# EAGLE board ma8x8_multiplexer (EAGLE 6.6.0), part 1 of 2
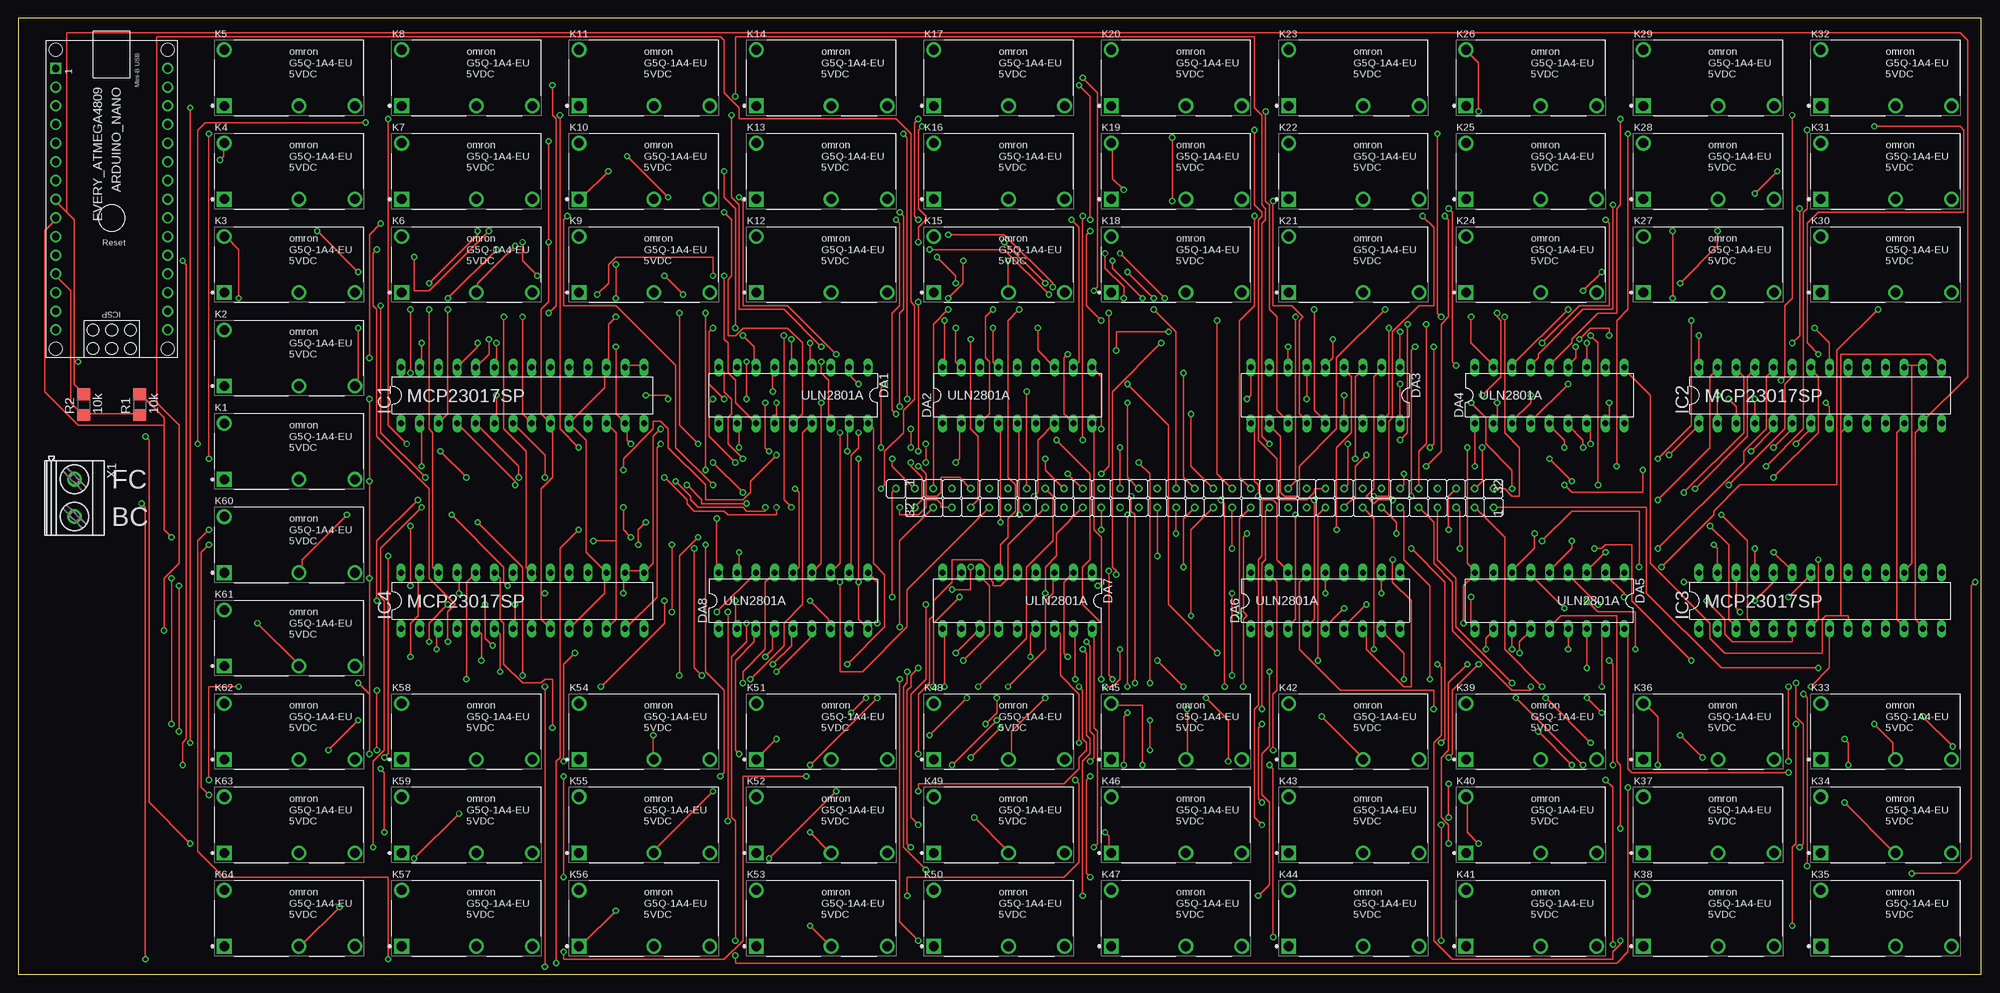
[diagram p1: board, top side]
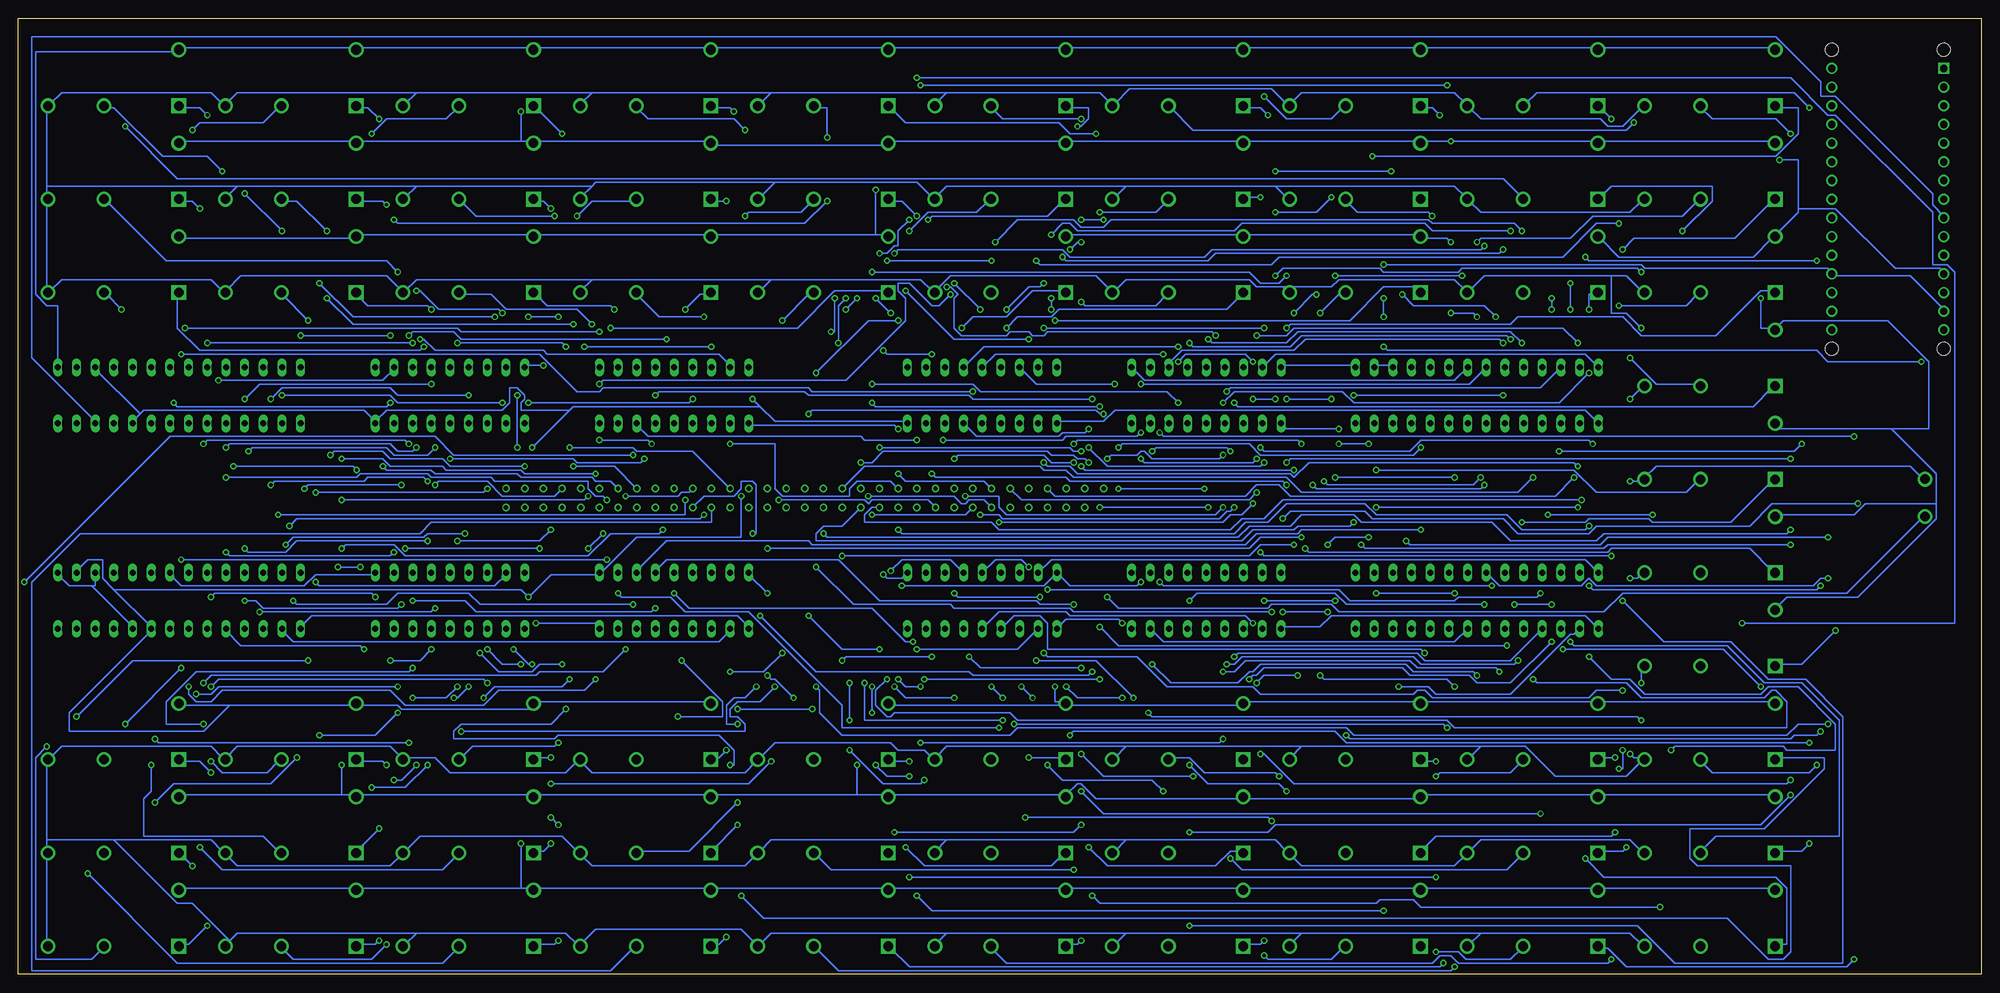
[diagram p2: board, bottom side, seen from below]

Size 267 x 130 mm. Coordinates in mm from the lower left corner, seen from the top.
Outline: 0,0 267,0 267,130 0,130 0,0
Copper layers (1*16): Top 0.035mm / dielectric 1.5mm / Bottom 0.035mm
Design rules "aisler_2_layer_simple": minimum track width 0.2mm, minimum drill 0.45mm, track to track 0.175mm, track to pad 0.175mm, pad to pad 0.175mm, via to via 0.175mm, smd to smd 0.175mm, copper to edge 0.3mm, drill to drill 0.25mm, minimum pad ring 0.2mm, minimum via ring 0.2mm, stop-mask expansion 0mil, vias tented up to drill 0mil, thermal gap 10mil

## Footprints (pad centres in the part's own frame; a part is rotated, then mirrored left to right if it is on the bottom)
ARDUINO_NANO = drill 1 square: 1 -20.32,-7.62 | drill 1: 2 -17.78,-7.62; 3 -15.24,-7.62; 4 -12.7,-7.62; 5 -10.16,-7.62; 6 -7.62,-7.62; 7 -5.08,-7.62; 8 -2.54,-7.62; 9 0,-7.62; 10 2.54,-7.62; 11 5.08,-7.62; 12 7.62,-7.62; 13 10.16,-7.62; 14 12.7,-7.62; 15 15.24,-7.62; 16 15.24,7.62; 17 12.7,7.62; 18 10.16,7.62; 19 7.62,7.62; 20 5.08,7.62; 21 2.54,7.62; 22 0,7.62; 23 -2.54,7.62; 24 -5.08,7.62; 25 -7.62,7.62; 26 -10.16,7.62; 27 -12.7,7.62; 28 -15.24,7.62; 29 -17.78,7.62; 30 -20.32,7.62 | hole 1.778: -22.86,-7.62; -22.86,7.62; 17.78,7.62; 17.78,-7.62
310-47-101-41-001000 = drill 0.6: 1 0,0
DIL18 = drill 0.813 long: 1 -10.16,-3.81; 2 -7.62,-3.81; 3 -5.08,-3.81; 4 -2.54,-3.81; 5 0,-3.81; 6 2.54,-3.81; 7 5.08,-3.81; 8 7.62,-3.81; 9 10.16,-3.81; 10 10.16,3.81; 11 7.62,3.81; 12 5.08,3.81; 13 2.54,3.81; 14 0,3.81; 15 -2.54,3.81; 16 -5.08,3.81; 17 -7.62,3.81; 18 -10.16,3.81
310-47-132-41-001000 = drill 0.6: 1 0,0; 2 0,2.54; 3 0,5.08; 4 0,7.62; 5 0,10.16; 6 0,12.7; 7 0,15.24; 8 0,17.78; 9 0,20.32; 10 0,22.86; 11 0,25.4; 12 0,27.94; 13 0,30.48; 14 0,33.02; 15 0,35.56; 16 0,38.1; 17 0,40.64; 18 0,43.18; 19 0,45.72; 20 0,48.26; 21 0,50.8; 22 0,53.34; 23 0,55.88; 24 0,58.42; 25 0,60.96; 26 0,63.5; 27 0,66.04; 28 0,68.58; 29 0,71.12; 30 0,73.66; 31 0,76.2; 32 0,78.74
DIL28-3 = drill 0.813 long: 1 -16.51,-3.81; 2 -13.97,-3.81; 3 -11.43,-3.81; 4 -8.89,-3.81; 5 -6.35,-3.81; 6 -3.81,-3.81; 7 -1.27,-3.81; 8 1.27,-3.81; 9 3.81,-3.81; 10 6.35,-3.81; 11 8.89,-3.81; 12 11.43,-3.81; 13 13.97,-3.81; 14 16.51,-3.81; 15 16.51,3.81; 16 13.97,3.81; 17 11.43,3.81; 18 8.89,3.81; 19 6.35,3.81; 20 3.81,3.81; 21 1.27,3.81; 22 -1.27,3.81; 23 -3.81,3.81; 24 -6.35,3.81; 25 -8.89,3.81; 26 -11.43,3.81; 27 -13.97,3.81; 28 -16.51,3.81
OMRON_G5Q-1A4-EU_DC5_0 = drill 1.3 pad 2 square: 1 -8.82,-3.81 | drill 1.3 pad 2: 2 1.34,-3.81; 3 8.96,-3.81; 5 -8.82,3.81
R1206 = smd 1.6 x 1.803: 1 -1.422,0; 2 1.422,0
MKDSN1,5/2-5,08 = drill 1.3 pad 2: 1 -2.561,0.025; 2 2.519,0.025

## Placement (x,y rotation side)
ARDUINO_NANO  EVERY_ATMEGA4809  [ARDUINO_NANO]  12.7,102.87 270 top
BC  310-47-101-41-001000  [310-47-101-41-001000]  119.38,66.04 0 top
DA1  ULN2801A  [DIL18]  105.41,78.74 180 top
DA2  ULN2801A  [DIL18]  135.89,78.74 0 top
DA3  ULN2801A  [DIL18]  177.8,78.74 180 top
DA4  ULN2801A  [DIL18]  208.28,78.74 0 top
DA5  ULN2801A  [DIL18]  208.28,50.8 180 top
DA6  ULN2801A  [DIL18]  177.8,50.8 0 top
DA7  ULN2801A  [DIL18]  135.89,50.8 180 top
DA8  ULN2801A  [DIL18]  105.41,50.8 0 top
H1  310-47-132-41-001000  [310-47-132-41-001000]  121.92,66.04 270 top
H2  310-47-132-41-001000  [310-47-132-41-001000]  200.66,63.5 90 top
IC1  MCP23017SP  [DIL28-3]  68.58,78.74 0 top
IC2  MCP23017SP  [DIL28-3]  245.11,78.74 0 top
IC3  MCP23017SP  [DIL28-3]  245.11,50.8 0 top
IC4  MCP23017SP  [DIL28-3]  68.58,50.8 0 top
K1  OMRON_G5Q-1A4-EU_DC5  [OMRON_G5Q-1A4-EU_DC5_0]  36.83,71.12 0 top
K2  OMRON_G5Q-1A4-EU_DC5  [OMRON_G5Q-1A4-EU_DC5_0]  36.83,83.82 0 top
K3  OMRON_G5Q-1A4-EU_DC5  [OMRON_G5Q-1A4-EU_DC5_0]  36.83,96.52 0 top
K4  OMRON_G5Q-1A4-EU_DC5  [OMRON_G5Q-1A4-EU_DC5_0]  36.83,109.22 0 top
K5  OMRON_G5Q-1A4-EU_DC5  [OMRON_G5Q-1A4-EU_DC5_0]  36.83,121.92 0 top
K6  OMRON_G5Q-1A4-EU_DC5  [OMRON_G5Q-1A4-EU_DC5_0]  60.96,96.52 0 top
K7  OMRON_G5Q-1A4-EU_DC5  [OMRON_G5Q-1A4-EU_DC5_0]  60.96,109.22 0 top
K8  OMRON_G5Q-1A4-EU_DC5  [OMRON_G5Q-1A4-EU_DC5_0]  60.96,121.92 0 top
K9  OMRON_G5Q-1A4-EU_DC5  [OMRON_G5Q-1A4-EU_DC5_0]  85.09,96.52 0 top
K10  OMRON_G5Q-1A4-EU_DC5  [OMRON_G5Q-1A4-EU_DC5_0]  85.09,109.22 0 top
K11  OMRON_G5Q-1A4-EU_DC5  [OMRON_G5Q-1A4-EU_DC5_0]  85.09,121.92 0 top
K12  OMRON_G5Q-1A4-EU_DC5  [OMRON_G5Q-1A4-EU_DC5_0]  109.22,96.52 0 top
K13  OMRON_G5Q-1A4-EU_DC5  [OMRON_G5Q-1A4-EU_DC5_0]  109.22,109.22 0 top
K14  OMRON_G5Q-1A4-EU_DC5  [OMRON_G5Q-1A4-EU_DC5_0]  109.22,121.92 0 top
K15  OMRON_G5Q-1A4-EU_DC5  [OMRON_G5Q-1A4-EU_DC5_0]  133.35,96.52 0 top
K16  OMRON_G5Q-1A4-EU_DC5  [OMRON_G5Q-1A4-EU_DC5_0]  133.35,109.22 0 top
K17  OMRON_G5Q-1A4-EU_DC5  [OMRON_G5Q-1A4-EU_DC5_0]  133.35,121.92 0 top
K18  OMRON_G5Q-1A4-EU_DC5  [OMRON_G5Q-1A4-EU_DC5_0]  157.48,96.52 0 top
K19  OMRON_G5Q-1A4-EU_DC5  [OMRON_G5Q-1A4-EU_DC5_0]  157.48,109.22 0 top
K20  OMRON_G5Q-1A4-EU_DC5  [OMRON_G5Q-1A4-EU_DC5_0]  157.48,121.92 0 top
K21  OMRON_G5Q-1A4-EU_DC5  [OMRON_G5Q-1A4-EU_DC5_0]  181.61,96.52 0 top
K22  OMRON_G5Q-1A4-EU_DC5  [OMRON_G5Q-1A4-EU_DC5_0]  181.61,109.22 0 top
K23  OMRON_G5Q-1A4-EU_DC5  [OMRON_G5Q-1A4-EU_DC5_0]  181.61,121.92 0 top
K24  OMRON_G5Q-1A4-EU_DC5  [OMRON_G5Q-1A4-EU_DC5_0]  205.74,96.52 0 top
K25  OMRON_G5Q-1A4-EU_DC5  [OMRON_G5Q-1A4-EU_DC5_0]  205.74,109.22 0 top
K26  OMRON_G5Q-1A4-EU_DC5  [OMRON_G5Q-1A4-EU_DC5_0]  205.74,121.92 0 top
K27  OMRON_G5Q-1A4-EU_DC5  [OMRON_G5Q-1A4-EU_DC5_0]  229.87,96.52 0 top
K28  OMRON_G5Q-1A4-EU_DC5  [OMRON_G5Q-1A4-EU_DC5_0]  229.87,109.22 0 top
K29  OMRON_G5Q-1A4-EU_DC5  [OMRON_G5Q-1A4-EU_DC5_0]  229.87,121.92 0 top
K30  OMRON_G5Q-1A4-EU_DC5  [OMRON_G5Q-1A4-EU_DC5_0]  254,96.52 0 top
K31  OMRON_G5Q-1A4-EU_DC5  [OMRON_G5Q-1A4-EU_DC5_0]  254,109.22 0 top
K32  OMRON_G5Q-1A4-EU_DC5  [OMRON_G5Q-1A4-EU_DC5_0]  254,121.92 0 top
K33  OMRON_G5Q-1A4-EU_DC5  [OMRON_G5Q-1A4-EU_DC5_0]  254,33.02 0 top
K34  OMRON_G5Q-1A4-EU_DC5  [OMRON_G5Q-1A4-EU_DC5_0]  254,20.32 0 top
K35  OMRON_G5Q-1A4-EU_DC5  [OMRON_G5Q-1A4-EU_DC5_0]  254,7.62 0 top
K36  OMRON_G5Q-1A4-EU_DC5  [OMRON_G5Q-1A4-EU_DC5_0]  229.87,33.02 0 top
K37  OMRON_G5Q-1A4-EU_DC5  [OMRON_G5Q-1A4-EU_DC5_0]  229.87,20.32 0 top
K38  OMRON_G5Q-1A4-EU_DC5  [OMRON_G5Q-1A4-EU_DC5_0]  229.87,7.62 0 top
K39  OMRON_G5Q-1A4-EU_DC5  [OMRON_G5Q-1A4-EU_DC5_0]  205.74,33.02 0 top
K40  OMRON_G5Q-1A4-EU_DC5  [OMRON_G5Q-1A4-EU_DC5_0]  205.74,20.32 0 top
K41  OMRON_G5Q-1A4-EU_DC5  [OMRON_G5Q-1A4-EU_DC5_0]  205.74,7.62 0 top
K42  OMRON_G5Q-1A4-EU_DC5  [OMRON_G5Q-1A4-EU_DC5_0]  181.61,33.02 0 top
K43  OMRON_G5Q-1A4-EU_DC5  [OMRON_G5Q-1A4-EU_DC5_0]  181.61,20.32 0 top
K44  OMRON_G5Q-1A4-EU_DC5  [OMRON_G5Q-1A4-EU_DC5_0]  181.61,7.62 0 top
K45  OMRON_G5Q-1A4-EU_DC5  [OMRON_G5Q-1A4-EU_DC5_0]  157.48,33.02 0 top
K46  OMRON_G5Q-1A4-EU_DC5  [OMRON_G5Q-1A4-EU_DC5_0]  157.48,20.32 0 top
K47  OMRON_G5Q-1A4-EU_DC5  [OMRON_G5Q-1A4-EU_DC5_0]  157.48,7.62 0 top
K48  OMRON_G5Q-1A4-EU_DC5  [OMRON_G5Q-1A4-EU_DC5_0]  133.35,33.02 0 top
K49  OMRON_G5Q-1A4-EU_DC5  [OMRON_G5Q-1A4-EU_DC5_0]  133.35,20.32 0 top
K50  OMRON_G5Q-1A4-EU_DC5  [OMRON_G5Q-1A4-EU_DC5_0]  133.35,7.62 0 top
K51  OMRON_G5Q-1A4-EU_DC5  [OMRON_G5Q-1A4-EU_DC5_0]  109.22,33.02 0 top
K52  OMRON_G5Q-1A4-EU_DC5  [OMRON_G5Q-1A4-EU_DC5_0]  109.22,20.32 0 top
K53  OMRON_G5Q-1A4-EU_DC5  [OMRON_G5Q-1A4-EU_DC5_0]  109.22,7.62 0 top
K54  OMRON_G5Q-1A4-EU_DC5  [OMRON_G5Q-1A4-EU_DC5_0]  85.09,33.02 0 top
K55  OMRON_G5Q-1A4-EU_DC5  [OMRON_G5Q-1A4-EU_DC5_0]  85.09,20.32 0 top
K56  OMRON_G5Q-1A4-EU_DC5  [OMRON_G5Q-1A4-EU_DC5_0]  85.09,7.62 0 top
K57  OMRON_G5Q-1A4-EU_DC5  [OMRON_G5Q-1A4-EU_DC5_0]  60.96,7.62 0 top
K58  OMRON_G5Q-1A4-EU_DC5  [OMRON_G5Q-1A4-EU_DC5_0]  60.96,33.02 0 top
K59  OMRON_G5Q-1A4-EU_DC5  [OMRON_G5Q-1A4-EU_DC5_0]  60.96,20.32 0 top
K60  OMRON_G5Q-1A4-EU_DC5  [OMRON_G5Q-1A4-EU_DC5_0]  36.83,58.42 0 top
K61  OMRON_G5Q-1A4-EU_DC5  [OMRON_G5Q-1A4-EU_DC5_0]  36.83,45.72 0 top
K62  OMRON_G5Q-1A4-EU_DC5  [OMRON_G5Q-1A4-EU_DC5_0]  36.83,33.02 0 top
K63  OMRON_G5Q-1A4-EU_DC5  [OMRON_G5Q-1A4-EU_DC5_0]  36.83,20.32 0 top
K64  OMRON_G5Q-1A4-EU_DC5  [OMRON_G5Q-1A4-EU_DC5_0]  36.83,7.62 0 top
R1  10k  [R1206]  16.51,77.47 90 top
R2  10k  [R1206]  8.89,77.47 90 top
X1  MKDSN1,5/2-5,08  [MKDSN1,5/2-5,08]  7.62,64.77 270 top

## Tracks (layer width: path | path; a pad name or v marks a point on that pad's centre or on a via)
5V  (via drill 0.45)
  Top 0.2: v147.32,74.17 147.32,81.28 DA2.10 | v197.61,51.31 197.61,47.75 198.12,47.24 DA5.10 | 247.9,48.77 248.92,48.77 IC3.9 | 247.9,48.77 245.87,48.77 245.36,48.26 245.36,43.69 232.16,43.69 230.12,45.72 230.12,47.75 222,55.88 222,78.74 218.44,82.3 DA4.10 | 247.9,73.66 248.92,74.68 IC2.9 | 247.9,48.77 247.9,73.66 | 247.9,73.66 247.9,84.33 260.1,84.33 261.62,82.8 IC2.15 | v168.66,65.02 168.66,66.55 168.15,67.06 168.15,74.17 167.64,74.68 DA3.10 | v125.98,39.12 125.98,46.74 DA7.10 | DA8.10 116.84,53.34 v116.84,47.75 | v223.01,28.45 223.01,35.05 221.49,36.58 K36.5 | v152.91,28.45 152.91,36.58 148.84,36.58 K45.5 | v198.63,17.78 197.1,19.3 197.1,23.88 K40.5 | v87.38,74.17 86.36,73.15 86.36,55.88 IC4.15 84.84,54.86 82.8,54.86 IC4.16 82.3,54.36 v82.3,51.82 | IC4.9 71.12,48.26 71.12,51.82 | 71.12,51.82 71.12,66.04 72.64,67.56 72.64,74.68 IC1.9 71.12,76.2 71.12,90.42 72.14,91.44 v72.14,99.57 v72.14,113.28 | 71.12,51.82 v71.63,51.82 | v29.97,91.95 29.97,98.55 28.45,100.08 K3.5 | v150.37,106.68 148.84,108.2 148.84,112.78 K19.5 | v27.43,110.74 27.94,111.25 27.94,112.78 K4.5 | v198.63,117.35 198.63,123.95 197.1,125.48 K26.5 | R1.1 16.26,76.2 9.14,76.2 R2.1 8.64,76.2 7.11,77.72 7.11,92.96 5.08,95 ARDUINO_NANO.12
  Bottom 0.2: K35.5 244.86,11.68 221.49,11.68 K38.5 220.98,11.68 198.63,11.68 | K64.5 28.45,11.68 51.82,11.68 K57.5 52.32,11.68 76.2,11.68 K56.5 76.71,11.68 100.08,11.68 K53.5 100.58,11.68 124.46,11.68 K50.5 124.97,11.68 148.34,11.68 K47.5 148.84,11.68 172.72,11.68 K44.5 173.23,11.68 196.6,11.68 K41.5 197.1,11.68 198.63,11.68 | v147.32,74.17 147.83,74.68 167.64,74.68 DA3.10 | 254,52.32 255.52,53.85 255.52,56.39 257.56,56.39 259.08,54.86 IC3.16 | 254,52.32 248.92,47.24 IC3.9 248.92,46.74 260.1,35.56 260.1,33.02 241.81,33.02 238.25,36.58 | 254,52.32 198.63,52.32 v197.61,51.31 194.56,54.36 187.96,54.36 DA6.10 187.96,54.86 187.45,54.86 182.88,59.44 168.66,59.44 v168.66,65.02 | v125.98,39.12 125.98,37.08 124.97,37.08 K48.5 | v116.84,47.75 117.35,48.26 124.46,48.26 DA7.10 | K45.5 148.34,36.58 124.97,36.58 K48.5 | K62.5 28.45,37.08 51.82,37.08 K58.5 52.32,37.08 76.2,37.08 K54.5 76.71,37.08 100.08,37.08 K51.5 100.58,36.58 124.46,36.58 K48.5 | K42.5 173.23,37.08 196.6,37.08 K39.5 197.1,36.58 197.61,36.07 214.88,36.07 215.39,36.58 220.98,36.58 K36.5 221.49,36.58 238.25,36.58 | 238.25,36.58 244.86,36.58 K33.5 | K63.5 28.45,24.38 51.82,24.38 K59.5 52.32,24.38 76.2,24.38 K55.5 76.71,23.88 100.08,23.88 K52.5 100.58,23.88 120.4,23.88 122.43,25.91 122.94,25.91 124.46,24.38 K49.5 124.97,24.38 148.34,24.38 K46.5 148.84,24.38 152.91,24.38 | 223.01,24.38 244.86,24.38 K34.5 | 223.01,24.38 221.49,24.38 K37.5 220.98,24.38 197.1,24.38 K40.5 196.6,24.38 173.23,24.38 K43.5 172.72,24.38 152.91,24.38 | 223.01,24.38 v223.01,28.45 | 152.91,24.38 v152.91,28.45 | v198.63,17.78 198.63,11.68
  Bottom 0.2: K5.5 28.45,125.98 51.82,125.98 K8.5 52.32,125.98 76.2,125.98 K11.5 76.71,125.98 100.08,125.98 K14.5 100.58,125.98 124.46,125.98 K17.5 124.97,125.98 148.34,125.98 K20.5 148.84,125.98 172.72,125.98 K23.5 173.23,125.98 196.6,125.98 K26.5 197.1,125.98 220.98,125.98 K29.5 221.49,125.98 244.86,125.98 K32.5 245.36,125.48 264.67,125.48 264.67,92.46 263.14,90.93 261.62,90.93 IC2.15 | DA1.10 94.49,74.17 v87.38,74.17 | K15.5 124.46,100.58 100.58,100.58 K12.5 100.08,100.58 76.71,100.58 K9.5 76.2,100.08 72.64,100.08 v72.14,99.57 | v71.63,51.82 v82.3,51.82 | K6.5 51.82,100.08 49.28,97.54 30.99,97.54 28.45,100.08 K3.5 27.94,100.58 24.89,103.63 24.89,104.14 | v29.97,91.95 29.97,87.88 28.45,87.88 K2.5 27.94,87.88 26.92,88.9 12.7,88.9 7.11,83.31 7.11,74.17 12.19,74.17 | K30.5 244.86,100.08 221.49,100.08 K27.5 220.98,100.58 197.1,100.58 K24.5 196.6,100.58 173.23,100.58 K21.5 172.72,100.58 150.37,100.58 | 150.37,100.58 148.84,100.58 K18.5 | K31.5 244.86,113.28 221.49,113.28 K28.5 220.98,113.28 198.63,113.28 | K4.5 28.45,113.28 51.82,113.28 K7.5 52.32,113.28 v72.14,113.28 76.2,113.28 K10.5 76.71,113.28 100.08,113.28 K13.5 100.58,113.28 124.46,113.28 K16.5 124.97,113.28 148.34,113.28 K19.5 148.84,112.78 172.72,112.78 K22.5 173.23,113.28 196.6,113.28 K25.5 197.1,113.28 198.63,113.28 | v150.37,106.68 150.37,100.58 | 24.89,104.14 24.89,110.74 v27.43,110.74 | 198.63,113.28 v198.63,117.35 | 24.89,104.14 19.81,104.14 11.68,96.01 5.59,96.01 5.08,95.5 ARDUINO_NANO.12 | 6.1,64.01 6.1,61.98 16.76,51.31 26.42,51.31 27.94,49.78 K61.5 | 6.1,64.01 15.75,64.01 17.27,62.48 27.94,62.48 K60.5
  Bottom 0.2: 12.19,74.17 27.43,74.17 27.94,74.68 K1.5 | 12.19,74.17 6.1,68.07 6.1,64.01
BC  (via drill 0.45)
  Top 0.2: BC.1 118.87,65.53 v118.87,51.31
  Bottom 0.2: v118.87,51.31 117.35,49.78 97.03,49.78 96.52,50.29 88.39,50.29 87.38,49.28 51.31,49.28 48.77,51.82 18.29,51.82 8.13,61.98 X1.2
FC  (via drill 0.45)
  Top 0.2: 47.75,38.1 v46.23,39.62 | v47.75,29.97 47.75,38.1 | 47.75,38.1 v47.75,53.85 v47.75,67.06 v47.75,78.23 | v46.23,87.88 46.23,80.26 K2.3
  Bottom 0.2: K5.3 46.23,117.86 48.77,115.32 50.8,115.32 51.82,116.33 68.07,116.33 69.6,117.86 K8.3 70.1,118.36 71.63,119.89 92.46,119.89 93.98,118.36 K11.3 94.49,118.36 96.52,120.4 115.82,120.4 117.86,118.36 K14.3 118.36,118.36 119.89,119.89 140.72,119.89 | 140.72,119.89 142.24,118.36 K17.3 | 164.59,119.89 166.12,118.36 K20.3 | 140.72,119.89 164.59,119.89 | 188.98,119.89 190.5,118.36 K23.3 | 164.59,119.89 188.98,119.89 | 212.85,119.89 214.38,118.36 K26.3 | 188.98,119.89 212.85,119.89 | 212.85,119.89 237.24,119.89 238.76,118.36 K29.3 239.27,118.36 240.79,119.89 261.11,119.89 262.64,118.36 K32.3 263.14,117.86 263.14,107.19 | 50.29,95 67.56,95 69.6,92.96 K6.3 70.1,92.96 71.63,94.49 87.38,94.49 88.39,93.47 95,93.47 | 50.29,95 48.26,95 46.23,92.96 K3.3 | 95,93.47 94.49,92.96 K9.3 | 95,93.47 98.55,93.47 99.57,94.49 116.33,94.49 117.86,92.96 K12.3 118.36,92.96 120.4,95 140.21,95 142.24,92.96 K15.3 142.75,92.96 144.27,94.49 164.59,94.49 | 164.59,94.49 166.12,92.96 K18.3 | 188.98,94.49 190.5,92.96 K21.3 | 164.59,94.49 188.98,94.49 | 188.98,94.49 212.85,94.49 214.38,92.96 K24.3 214.88,92.96 216.92,95 236.73,95 238.76,92.96 K27.3 239.27,92.96 240.79,94.49 261.11,94.49 262.64,92.96 K30.3 263.14,92.96 263.14,105.16 K31.3 263.14,105.66 263.14,107.19 | K4.3 46.23,105.16 47.75,103.63 68.07,103.63 69.6,105.16 K7.3 70.1,105.66 71.63,107.19 96.01,107.19 | 96.01,107.19 94.49,105.66 K10.3 | 116.33,107.19 96.01,107.19 | 116.33,107.19 117.86,105.66 K13.3 | 116.33,107.19 140.72,107.19 142.24,105.66 K16.3 142.75,105.66 144.78,107.7 164.08,107.7 | 164.08,107.7 166.12,105.66 K19.3
  Bottom 0.2: 188.98,107.19 188.47,107.7 164.08,107.7 | 188.98,107.19 190.5,105.66 K22.3 | 212.85,107.19 214.38,105.66 K25.3 | 188.98,107.19 212.85,107.19 | 237.24,107.19 238.76,105.66 K28.3 | 212.85,107.19 237.24,107.19 | 237.24,107.19 263.14,107.19 | X1.1 8.13,67.56 9.65,69.09 44.2,69.09 45.72,67.56 K1.3 46.23,67.06 v47.75,67.06 | 68.07,30.99 61.98,30.99 57.91,26.92 48.26,26.92 46.23,28.96 K62.3 46.23,29.46 47.24,29.46 v47.75,29.97 | 68.07,30.99 69.6,29.46 K58.3 | 92.46,30.99 93.98,29.46 K54.3 | 68.07,30.99 92.46,30.99 | 116.33,30.99 117.86,29.46 K51.3 | 92.46,30.99 116.33,30.99 | 116.33,30.99 140.72,30.99 142.24,29.46 K48.3 142.75,29.46 143.76,30.48 147.32,30.48 148.34,31.5 164.08,31.5 166.12,29.46 K45.3 166.62,28.96 168.15,27.43 188.98,27.43 190.5,28.96 K42.3 191.01,28.96 192.53,27.43 208.28,27.43 210.31,29.46 214.38,29.46 K39.3 214.88,29.46 216.41,30.99 237.24,30.99 238.76,29.46 K36.3 239.27,29.46 240.79,30.99 261.11,30.99 262.64,29.46 K33.3 263.14,28.96 263.14,18.29 | v46.23,39.62 46.23,41.66 K61.3 | v47.75,53.85 46.74,53.85 46.23,54.36 K60.3 | v47.75,78.23 46.23,79.76 K2.3 | K63.3 46.23,16.76 47.75,18.29 68.07,18.29 69.6,16.76 K59.3 70.1,16.26 71.63,14.73 92.46,14.73 93.98,16.26 K55.3 94.49,16.76 96.01,18.29 116.33,18.29 | 116.33,18.29 117.86,16.76 K52.3 | 140.72,18.29 142.24,16.76 K49.3 | 116.33,18.29 140.72,18.29 | 140.72,18.29 164.59,18.29 166.12,16.76 K46.3 166.62,16.26 168.15,14.73 188.98,14.73 190.5,16.26 K43.3 191.01,16.76 193.04,18.8 212.34,18.8 214.38,16.76 K40.3 214.88,16.26 216.41,14.73 237.24,14.73 238.76,16.26 K37.3 239.27,16.76 240.79,18.29 254,18.29
  Bottom 0.2: 68.07,5.59 47.75,5.59 46.23,4.06 K64.3 | 68.07,5.59 69.6,4.06 K57.3 | 92.46,5.59 93.98,4.06 K56.3 | 68.07,5.59 92.46,5.59 | 116.33,5.59 117.86,4.06 K53.3 | 92.46,5.59 116.33,5.59 | 140.72,5.59 142.24,4.06 K50.3 | 116.33,5.59 140.72,5.59 | 140.72,5.59 164.59,5.59 166.12,4.06 K47.3 166.62,4.06 168.66,6.1 188.47,6.1 190.5,4.06 K44.3 191.01,4.06 192.53,5.59 212.85,5.59 | 212.85,5.59 214.38,4.06 K41.3 | 238.25,4.57 237.24,5.59 212.85,5.59 | 238.25,4.57 238.76,4.06 K38.3 238.25,4.57 | K35.3 263.14,4.06 263.14,16.26 K34.3 263.14,16.76 263.14,18.29 | 263.14,18.29 254,18.29 | 238.25,4.57 243.33,9.65 245.36,9.65 254,18.29 | 50.29,95 50.29,89.92 48.26,89.92 v46.23,87.88
GND  (via drill 0.45)
  Top 0.2: IC1.16 82.8,82.8 84.84,82.8 IC1.15 | IC4.10 79.76,51.82 79.76,54.36 IC4.17 77.22,57.4 77.22,72.64 IC1.10 79.76,79.76 79.76,82.3 IC1.17 80.26,82.8 80.26,88.39 v81.28,89.41 | 257.56,82.8 259.08,82.8 IC2.16 | 257.56,82.8 256.54,82.8 IC2.17 | 257.56,82.8 257.56,55.88 256.54,54.86 IC3.17 | v196.6,47.75 196.6,52.83 198.12,54.36 DA5.9 198.12,54.86 197.1,55.88 v197.1,71.63 | DA8.9 114.3,48.26 v114.3,53.34 v114.3,70.1 | v167.13,78.23 167.64,78.74 DA3.9 | v146.81,52.83 147.32,53.34 147.32,59.44 146.3,60.45 146.3,74.68 DA2.9 | DA1.9 96.01,81.79 96.01,79.25 97.03,78.23 97.03,76.2 96.52,75.69 96.52,72.14 v98.55,70.1 | v81.28,91.95 v81.28,96.52
  Bottom 0.2: DA1.9 95,82.8 85.34,82.8 IC1.15 | IC1.16 82.3,82.8 80.26,82.8 IC1.17 | 257.05,52.83 251.46,47.24 IC3.10 | 257.05,52.83 260.1,52.83 261.62,54.36 IC3.15 | IC3.17 256.54,52.83 257.05,52.83 | 218.44,75.18 219.96,76.71 249.94,76.71 250.44,76.2 | 250.44,76.2 251.46,75.18 IC2.10 | 250.44,76.2 256.54,82.3 IC2.17 | v196.6,47.75 188.47,47.75 187.96,47.24 DA6.9 | v114.3,53.34 114.81,52.83 123.95,52.83 DA7.9 127.51,52.83 v146.81,52.83 | v167.13,78.23 166.12,77.22 | 166.12,77.22 164.08,75.18 146.3,75.18 DA2.9 | 192.02,76.71 191.52,77.22 166.12,77.22 | 192.02,76.71 v197.1,71.63 | 218.44,75.18 216.92,76.71 201.17,76.71 200.15,77.72 200.15,79.76 199.14,79.76 198.12,78.74 198.12,78.23 198.63,77.72 198.63,76.71 192.02,76.71 | 218.44,75.18 DA4.9 | v98.55,70.1 99.06,69.6 113.79,69.6 v114.3,70.1 | ARDUINO_NANO.14 5.08,90.42 9.65,95 20.32,95 ARDUINO_NANO.19 20.32,95.5 20.83,96.01 45.72,96.01 46.23,96.52 v81.28,96.52 | v81.28,89.41 v81.28,91.95
H1  (via drill 0.45)
  Top 0.2: H1.1 118.87,69.09 v118.87,70.1 | v103.12,70.61 99.57,67.06 99.57,65.53 98.55,64.52 93.47,64.52 93.47,66.55 88.39,71.63 88.39,74.17 87.38,75.18 86.36,75.18 86.36,74.17 82.3,70.1 v82.3,68.58
  Bottom 0.2: v118.87,70.1 118.36,70.61 114.81,70.61 114.3,71.12 113.79,71.12 112.78,70.1 103.63,70.1 v103.12,70.61 | v82.3,68.58 55.37,68.58 52.32,65.53 40.13,65.53 38.61,67.06 K1.2
H2  (via drill 0.45)
  Top 0.2: H1.2 124.46,88.39 v126.49,90.42 | v126.49,91.95 128.52,93.98 v128.52,97.03 | v49.28,102.11 47.75,100.58 v47.75,83.82
  Bottom 0.2: v126.49,91.95 v126.49,90.42 | v128.52,97.03 128.02,96.52 96.52,96.52 95.5,97.54 56.9,97.54 52.32,102.11 v49.28,102.11 | v47.75,83.82 44.2,80.26 38.61,80.26 K2.2
H3  (via drill 0.45)
  Top 0.2: v55.37,67.56 49.28,73.66 v49.28,90.93
  Bottom 0.2: H1.3 125.98,65.02 100.08,65.02 98.55,66.55 95.5,66.55 93.98,65.02 57.91,65.02 v55.37,67.56 | v49.28,90.93 40.13,90.93 38.61,92.46 K3.2
H4  (via drill 0.45)
  Top 0.2: H1.4 128.02,67.56 125.48,67.56 125.48,65.53 124.97,65.02 123.44,65.02 123.44,68.07 v122.43,69.09 | v93.47,89.92 v93.47,68.58 | v87.88,95 v90.42,92.46 | v70.61,95 68.58,97.03 v68.58,99.57
  Bottom 0.2: v122.43,69.09 121.92,68.58 v93.47,68.58 | v93.47,89.92 90.93,92.46 v90.42,92.46 | v70.61,95 v87.88,95 | v68.58,99.57 68.07,100.08 55.88,100.08 52.83,103.12 40.64,103.12 38.61,105.16 K4.2
H5  (via drill 0.45)
  Top 0.2: v94.49,69.6 v98.55,65.53 | v25.91,114.3 v25.91,70.1
  Bottom 0.2: H1.5 130.56,64.52 99.57,64.52 v98.55,65.53 | v94.49,69.6 93.98,70.1 v25.91,70.1 | v25.91,114.3 27.94,116.33 36.58,116.33 38.1,117.86 K5.2
H6  (via drill 0.45)
  Top 0.2: v147.32,68.07 148.34,69.09 v148.34,89.92 | v150.37,91.95 150.37,93.47 147.83,96.01 v147.83,98.04 | v67.56,99.06 62.48,93.98 62.48,92.96 K6.2
  Bottom 0.2: H1.6 135.64,67.06 146.3,67.06 v147.32,68.07 | v150.37,91.95 v148.34,89.92 | v147.83,98.04 147.32,98.55 124.97,98.55 123.95,97.54 105.66,97.54 104.65,98.55 68.07,98.55 v67.56,99.06
H7  (via drill 0.45)
  Top 0.2: v137.16,79.25 H1.7 | v244.86,84.33 243.33,85.85 243.33,102.11 244.86,103.63 264.67,103.63 264.67,114.81 264.16,115.32 v252.48,115.32
  Bottom 0.2: v137.16,79.25 159,79.25 159.51,79.76 187.45,79.76 187.96,79.25 191.01,79.25 196.09,84.33 v244.86,84.33 | v252.48,115.32 245.36,108.2 65.02,108.2 62.48,105.66 K7.2
H8  (via drill 0.45)
  Top 0.2: H1.8 140.72,65.02 140.72,58.93 137.16,55.37 137.16,45.72 v130.56,39.12 | v123.95,32.51 v129.03,37.59 | v23.37,117.86 v23.37,31.5
  Bottom 0.2: v129.03,37.59 v130.56,39.12 | v123.95,32.51 123.44,33.02 87.88,33.02 86.36,31.5 v23.37,31.5 | v23.37,117.86 25.4,119.89 60.45,119.89 61.98,118.36 K8.2
H9  (via drill 0.45)
  Top 0.2: H1.9 139.7,68.58 v139.7,70.1 | v123.44,72.14 v123.44,69.6 | v92.46,72.14 89.92,74.68 v89.92,89.92
  Bottom 0.2: v139.7,70.1 139.19,70.61 127.51,70.61 126.49,69.6 v123.44,69.6 | v123.44,72.14 122.94,72.64 92.96,72.64 v92.46,72.14 | v89.92,89.92 87.38,92.46 86.87,92.46 K9.2
H10  (via drill 0.45)
  Top 0.2: v142.75,68.07 H1.10 | v94.49,66.55 89.41,71.63 89.41,82.8 81.28,90.93 74.17,90.93 74.17,102.62 v74.68,103.12
  Bottom 0.2: v142.75,68.07 142.24,67.56 124.46,67.56 123.95,67.06 95,67.06 v94.49,66.55 | v74.68,103.12 75.18,103.63 84.84,103.63 86.36,105.16 K10.2
H11  (via drill 0.45)
  Top 0.2: v170.18,72.14 169.16,73.15 169.16,102.11 169.67,102.62 169.67,104.14 169.16,104.65 169.16,116.84 168.15,117.86 168.15,127.51 97.54,127.51 v97.54,119.38
  Bottom 0.2: H1.11 148.34,67.06 152.91,67.06 153.92,66.04 153.92,65.02 163.07,65.02 164.08,66.04 164.08,72.14 v170.18,72.14 | v97.54,119.38 94.49,116.33 88.39,116.33 86.87,117.86 K11.2
H12  (via drill 0.45)
  Top 0.2: v149.86,71.63 H1.12 | v122.43,91.44 v122.43,71.12
  Bottom 0.2: v149.86,71.63 123.95,71.63 123.44,71.12 v122.43,71.12 | v122.43,91.44 121.92,90.93 112.27,90.93 110.74,92.46 K12.2
H13  (via drill 0.45)
  Top 0.2: H1.13 150.88,67.56 v150.88,77.72 | v119.89,77.22 119.89,89.92 120.4,90.42 120.4,103.12 v119.89,103.63
  Bottom 0.2: v150.88,77.72 150.37,77.22 v119.89,77.22 | v119.89,103.63 112.27,103.63 110.74,105.16 K13.2
H14  (via drill 0.45)
  Top 0.2: v57.4,71.12 v60.96,67.56 | v24.38,72.14 24.38,114.81 25.4,115.82 v47.24,115.82
  Bottom 0.2: H1.14 151.89,69.09 128.02,69.09 127.51,68.58 124.46,68.58 123.44,67.56 94.49,67.56 92.46,65.53 62.99,65.53 v60.96,67.56 | v57.4,71.12 25.4,71.12 v24.38,72.14 | v47.24,115.82 48.26,114.81 107.19,114.81 110.24,117.86 K14.2
H15  (via drill 0.45)
  Top 0.2: H1.15 157.48,87.38 v154.43,90.42 | v152.91,91.95 148.84,96.01 v148.84,97.03 | v134.62,97.03 134.62,92.96 K15.2
  Bottom 0.2: v152.91,91.95 v154.43,90.42 | v134.62,97.03 v148.84,97.03
H16  (via drill 0.45)
  Top 0.2: H1.16 158.5,67.56 v158.5,81.79 | v147.32,88.9 145.29,90.93 145.29,100.58 v145.8,101.09
  Bottom 0.2: v158.5,81.79 151.38,88.9 v147.32,88.9 | v145.8,101.09 143.26,103.63 136.65,103.63 135.13,105.16 K16.2
H17  (via drill 0.45)
  Top 0.2: H1.17 159.51,69.09 v159.51,76.2 | v119.38,76.2 118.87,76.71 118.87,89.92 119.89,90.93 119.89,102.11 v119.38,102.62 | v122.43,102.62 121.92,103.12 121.92,115.82 v122.43,116.33
  Bottom 0.2: v159.51,76.2 159,76.71 120.4,76.71 119.89,76.2 v119.38,76.2 | v122.43,102.62 v119.38,102.62 | v122.43,116.33 133.1,116.33 134.62,117.86 K17.2
H18  (via drill 0.45)
  Top 0.2: H1.18 163.07,68.07 v163.07,88.9
  Bottom 0.2: v163.07,88.9 159.51,92.46 159,92.46 K18.2
H19  (via drill 0.45)
  Top 0.2: H1.19 166.12,67.56 166.12,88.9 168.15,90.93 v168.15,103.12
  Bottom 0.2: v168.15,103.12 167.64,103.63 160.53,103.63 159,105.16 K19.2
H20  (via drill 0.45)
  Top 0.2: v192.02,71.63 192.53,72.14 v192.53,85.34 | v207.26,85.85 212.34,90.93 216.41,90.93 216.41,102.11 v215.9,102.62 | v156.97,113.79 v156.97,105.16
  Bottom 0.2: H1.20 175.26,71.12 182.88,71.12 183.39,71.63 v192.02,71.63 | v192.53,85.34 193.04,85.85 v207.26,85.85 | v215.9,102.62 215.39,102.11 160.02,102.11 v156.97,105.16 | v156.97,113.79 156.97,117.86 158.5,117.86 K20.2
H21  (via drill 0.45)
  Top 0.2: H1.21 173.74,67.06 v173.74,89.41
  Bottom 0.2: v173.74,89.41 179.83,89.41 182.88,92.46 K21.2
H22  (via drill 0.45)
  Top 0.2: v184.4,65.02 186.44,65.02 186.44,75.18 186.94,75.69 186.94,87.38 190.5,90.93 192.53,90.93 192.53,101.6 v191.01,103.12
  Bottom 0.2: H1.22 175.77,65.53 176.78,65.53 177.29,65.02 v184.4,65.02 | v191.01,103.12 188.98,105.16 183.39,105.16 K22.2
H23  (via drill 0.45)
  Top 0.2: H1.23 176.28,66.04 176.28,65.53 175.26,64.52 171.7,64.52 171.2,65.02 171.2,70.1 168.66,72.64 168.66,102.62 169.16,103.12 169.16,103.63 168.15,104.65 v168.15,114.81
  Bottom 0.2: v168.15,114.81 169.67,116.33 181.36,116.33 182.88,117.86 K23.2
H24  (via drill 0.45)
  Top 0.2: H1.24 180.85,66.55 v180.85,72.14 | v187.96,72.64 188.98,73.66 v188.98,88.39
  Bottom 0.2: v180.85,72.14 181.36,72.64 v187.96,72.64 | v188.98,88.39 191.01,90.42 200.66,90.42 202.69,92.46 206.76,92.46 K24.2
H25  (via drill 0.45)
  Top 0.2: v191.52,69.09 193.55,71.12 193.55,88.39 194.56,89.41 194.56,102.62 v194.06,103.12
  Bottom 0.2: H1.25 185.93,69.09 v191.52,69.09 | v194.06,103.12 204.72,103.12 206.76,105.16 K25.2
H26  (via drill 0.45)
  Top 0.2: v217.42,69.09 217.42,88.9 218.95,90.42 v218.95,114.3
  Bottom 0.2: H1.26 186.44,67.06 188.47,67.06 188.98,67.56 198.63,67.56 199.14,68.07 210.31,68.07 210.82,68.58 216.92,68.58 v217.42,69.09 | v218.95,114.3 216.92,116.33 208.79,116.33 207.26,117.86 K26.2
H27  (via drill 0.45)
  Top 0.2: H1.27 188.47,66.55 v188.47,68.07 | v223.01,70.1 227.58,74.68 v227.58,88.9
  Bottom 0.2: v188.47,68.07 198.12,68.07 198.63,68.58 208.79,68.58 209.3,69.09 216.41,69.09 217.42,70.1 v223.01,70.1 | v227.58,88.9 231.14,92.46 K27.2
H28  (via drill 0.45)
  Top 0.2: H1.28 190.5,71.12 191.52,72.14 v191.52,88.39 | v225.04,101.09 v225.04,91.95
  Bottom 0.2: v191.52,88.39 221.49,88.39 v225.04,91.95 | v225.04,101.09 229.11,105.16 231.14,105.16 K28.2
H29  (via drill 0.45)
  Top 0.2: v210.31,66.55 211.33,65.53 220.98,65.53 v220.98,68.58 | v237.74,69.09 242.82,74.17 242.82,103.63 243.33,104.14 v243.33,114.81
  Bottom 0.2: H1.29 194.06,65.02 201.17,65.02 203.2,67.06 209.8,67.06 v210.31,66.55 | v220.98,68.58 221.49,69.09 v237.74,69.09 | v243.33,114.81 242.32,115.82 233.68,115.82 231.65,117.86 K29.2
H30  (via drill 0.45)
  Top 0.2: H1.30 194.56,65.02 v194.56,60.45 | v207.26,58.93 211.33,62.99 220.47,62.99 v220.47,55.37 | v223.52,55.37 230.63,62.48 230.63,62.99 234.19,66.55 247.4,66.55 247.4,84.84 v252.98,90.42
  Bottom 0.2: v194.56,60.45 196.09,58.93 v207.26,58.93 | v223.52,55.37 v220.47,55.37 | v252.98,90.42 255.02,92.46 K30.2
H31  (via drill 0.45)
  Top 0.2: H1.31 199.14,67.06 v199.14,71.63 | v199.14,78.74 201.68,81.28 201.68,88.9 201.17,89.41 v201.17,89.92 | v215.39,95.5 v212.85,92.96
  Bottom 0.2: v199.14,78.74 v199.14,71.63 | v201.17,89.92 201.68,90.42 209.8,90.42 212.34,92.96 v212.85,92.96 | v215.39,95.5 216.92,97.03 246.89,97.03 255.02,105.16 K31.2
H32  (via drill 0.45)
  Top 0.2: H1.32 202.18,66.04 203.2,65.02 204.22,65.02 204.22,71.63 202.18,73.66 v202.18,89.41 | v226.06,93.98 231.14,99.06 v231.14,101.09 | v239.27,109.22 v236.22,106.17
  Bottom 0.2: v202.18,89.41 221.49,89.41 v226.06,93.98 | v236.22,106.17 v231.14,101.09 | v239.27,109.22 241.3,111.25 247.4,111.25 254,117.86 255.02,117.86 K32.2
H33  (via drill 0.45)
  Top 0.2: H2.1 221.49,63.5 221.49,51.82 231.65,41.66 v244.86,41.66 | v252.48,34.04 255.02,31.5 255.02,29.46 K33.2
  Bottom 0.2: v252.48,34.04 v244.86,41.66
H34  (via drill 0.45)
  Top 0.2: H2.2 202.18,59.44 202.18,44.2 v207.26,39.12 | v215.39,35.56 v213.36,37.59 | v229.11,29.46 v226.06,32.51 | v248.41,23.37 255.02,16.76 K34.2
  Bottom 0.2: v207.26,39.12 208.79,37.59 v213.36,37.59 | v215.39,35.56 218.44,32.51 v226.06,32.51 | v229.11,29.46 232.66,25.91 245.87,25.91 v248.41,23.37
H35  (via drill 0.45)
  Top 0.2: H2.3 196.09,62.99 v196.09,57.91 | v214.38,57.91 215.39,57.91 215.9,58.42 219.46,58.42 219.46,50.8 v227.58,42.67 | v263.14,30.99 v259.08,35.05
  Bottom 0.2: v214.38,57.91 v196.09,57.91 | v227.58,42.67 251.46,42.67 v259.08,35.05 | v263.14,30.99 264.67,29.46 264.67,2.03 257.05,2.03 255.52,3.56 K35.2
H36  (via drill 0.45)
  Top 0.2: H2.4 193.04,56.39 195.58,53.85 195.58,47.24 v203.2,39.62 | v240.79,28.96 v240.79,39.12
  Bottom 0.2: v203.2,39.62 203.71,40.13 239.78,40.13 v240.79,39.12 | v240.79,28.96 239.27,27.43 233.17,27.43 231.65,28.96 K36.2
H37  (via drill 0.45)
  Top 0.2: H2.5 192.53,61.47 192.53,55.88 195.07,53.34 195.07,46.74 203.2,38.61 205.74,38.61 v205.74,39.12 | v213.87,31.5 v207.77,37.59 | v248.41,32 248.92,31.5 v248.92,28.45
  Bottom 0.2: v205.74,39.12 207.26,37.59 v207.77,37.59 | v213.87,31.5 247.9,31.5 v248.41,32 | v248.92,28.45 248.92,24.89 249.94,23.88 249.94,18.8 233.68,18.8 231.65,16.76 K37.2
H38  (via drill 0.45)
  Top 0.2: H2.6 188.47,62.99 188.47,56.39 192.02,52.83 v192.02,40.13 | v212.85,28.45 v203.71,37.59 | v215.9,26.42 216.92,25.4 v216.92,4.06
  Bottom 0.2: v192.02,40.13 193.04,39.12 202.18,39.12 v203.71,37.59 | v212.85,28.45 214.88,26.42 v215.9,26.42 | v216.92,4.06 218.95,2.03 229.62,2.03 231.14,3.56 K38.2
H39  (via drill 0.45)
  Top 0.2: H2.7 187.45,61.47 v187.45,59.94 | v189.48,57.91 194.06,53.34 194.06,32 v193.55,31.5
  Bottom 0.2: v189.48,57.91 v187.45,59.94 | v193.55,31.5 194.06,30.99 205.23,30.99 206.76,29.46 K39.2
H40  (via drill 0.45)
  Top 0.2: H2.8 184.4,61.98 v184.4,44.2 | v241.81,39.62 241.81,35.05 242.82,34.04 242.82,17.78 v242.32,17.27
  Bottom 0.2: v184.4,44.2 187.45,41.15 196.09,41.15 196.6,40.64 240.79,40.64 v241.81,39.62 | v242.32,17.27 239.27,14.22 209.3,14.22 207.26,16.26 K40.2
H41  (via drill 0.45)
  Top 0.2: H2.9 181.86,65.02 181.86,69.09 v183.39,70.61 | v266.19,53.34 265.68,52.83 265.68,15.75 263.65,13.72 v257.56,13.72
  Bottom 0.2: v183.39,70.61 207.77,70.61 210.31,73.15 246.38,73.15 v266.19,53.34 | v257.56,13.72 245.36,1.52 209.3,1.52 207.26,3.56 K41.2
H42  (via drill 0.45)
  Top 0.2: H2.10 176.78,62.48 v176.78,42.67 | v177.29,35.05 182.88,29.46 K42.2
  Bottom 0.2: v176.78,42.67 171.2,37.08 171.2,35.05 v177.29,35.05
H43  (via drill 0.45)
  Top 0.2: v167.13,59.94 166.62,59.44 166.62,49.28 167.13,48.77 166.62,48.26 v166.62,39.12 | v169.16,34.04 168.66,33.53 168.66,23.88 v169.16,23.37
  Bottom 0.2: H2.11 173.74,65.02 169.67,65.02 168.66,66.04 168.66,67.06 167.13,67.06 166.62,66.55 166.62,59.94 v167.13,59.94 | v166.62,39.12 168.15,37.59 169.67,37.59 170.69,36.58 170.69,34.04 v169.16,34.04 | v169.16,23.37 175.77,16.76 182.88,16.76 K43.2
H44
  Bottom 0.2: H2.12 172.72,61.47 210.82,61.47 212.34,59.94 258.57,59.94 265.18,53.34 265.18,0.51 186.44,0.51 183.39,3.56 K44.2
H45  (via drill 0.45)
  Top 0.2: H2.13 169.67,62.99 169.67,56.39 169.16,55.88 v169.16,36.07 | v159,36.07 159,29.46 K45.2
  Bottom 0.2: v159,36.07 v169.16,36.07
H46  (via drill 0.45)
  Top 0.2: H2.14 166.12,61.98 v166.12,48.77 | v120.9,41.15 120.9,39.62 120.4,39.12 120.4,17.27 v123.44,14.22
  Bottom 0.2: v166.12,48.77 158.5,41.15 137.67,41.15 137.16,40.64 121.41,40.64 v120.9,41.15 | v123.44,14.22 156.46,14.22 158.5,16.26 K46.2
H47  (via drill 0.45)
  Top 0.2: v165.1,57.91 H2.15 | v92.46,59.44 89.92,56.9 v89.92,40.64 | v71.63,1.02 v71.63,39.12
  Bottom 0.2: v165.1,57.91 99.57,57.91 98.04,59.44 v92.46,59.44 | v89.92,40.64 89.41,40.13 72.64,40.13 v71.63,39.12 | v71.63,1.02 72.14,0.51 155.45,0.51 158.5,3.56 K47.2
H48  (via drill 0.45)
  Top 0.2: H2.16 159.51,60.45 v159.51,48.77 | v149.86,44.2 149.86,40.13 148.84,39.12 v147.83,39.12 | v139.7,37.59 135.13,33.02 135.13,29.46 K48.2
  Bottom 0.2: v159.51,48.77 154.94,44.2 v149.86,44.2 | v147.83,39.12 146.3,37.59 v139.7,37.59
H49  (via drill 0.45)
  Top 0.2: H2.17 158.5,61.98 v158.5,55.37 | v96.52,20.83 v96.52,49.28 | v130.05,21.34 134.62,16.76 K49.2
  Bottom 0.2: v158.5,55.37 153.42,50.29 140.21,50.29 139.7,49.78 123.95,49.78 123.44,49.28 v96.52,49.28 | v96.52,20.83 97.03,21.34 v130.05,21.34
H50  (via drill 0.45)
  Top 0.2: v157.48,59.94 H2.18 | v25.91,60.45 24.38,58.93 24.38,16.76 27.94,13.21 50.29,13.21 v50.29,2.03
  Bottom 0.2: v157.48,59.94 156.97,59.44 101.09,59.44 99.57,60.96 93.98,60.96 92.46,62.48 85.34,62.48 84.33,61.47 66.55,61.47 64.01,58.93 52.32,58.93 51.31,59.94 26.42,59.94 v25.91,60.45 | v50.29,2.03 50.8,1.52 71.12,1.52 72.14,2.54 73.66,2.54 74.68,1.52 132.59,1.52 134.62,3.56 K50.2
H51  (via drill 0.45)
  Top 0.2: v154.94,56.9 H2.19 | v93.47,58.42 93.47,41.15 96.01,38.61 96.01,27.43 v95.5,26.92
  Bottom 0.2: v154.94,56.9 99.57,56.9 98.04,58.42 v93.47,58.42 | v95.5,26.92 96.01,27.43 105.66,27.43 107.7,29.46 110.24,29.46 K51.2
H52  (via drill 0.45)
  Top 0.2: v85.34,61.47 84.33,60.45 v84.33,58.42 | v25.91,58.42 24.89,57.4 24.89,25.4 v25.91,24.38 | v107.7,19.3 110.24,16.76 K52.2
  Bottom 0.2: H2.20 154.94,60.96 157.48,60.96 158.5,59.94 158.5,58.93 100.58,58.93 99.06,60.45 93.47,60.45 92.96,60.96 85.85,60.96 v85.34,61.47 | v84.33,58.42 83.82,57.91 51.31,57.91 50.8,58.42 v25.91,58.42 | v25.91,24.38 29.97,20.32 96.01,20.32 97.03,19.3 v107.7,19.3
H53  (via drill 0.45)
  Top 0.2: v54.36,64.52 48.77,58.93 v48.77,50.8 | v107.7,6.6 110.24,4.06 K53.2
  Bottom 0.2: H2.21 150.88,63.5 151.89,62.48 151.89,61.47 134.62,61.47 133.6,60.45 102.11,60.45 100.58,61.98 97.54,61.98 95,64.52 v54.36,64.52 | v48.77,50.8 43.18,45.21 34.04,45.21 28.96,40.13 23.88,40.13 18.8,35.05 18.8,1.52 41.66,1.52 46.74,6.6 v107.7,6.6
H54  (via drill 0.45)
  Top 0.2: v147.32,60.45 H2.22 | v53.34,52.83 v53.34,60.96 | v21.84,33.02 v21.84,52.83 | v86.36,32.51 86.36,29.46 K54.2
  Bottom 0.2: v147.32,60.45 146.81,59.94 101.6,59.94 100.08,61.47 97.03,61.47 94.49,64.01 83.82,64.01 82.3,62.48 64.52,62.48 62.48,60.45 53.85,60.45 v53.34,60.96 | v53.34,52.83 52.83,52.32 22.35,52.32 v21.84,52.83 | v21.84,33.02 22.35,32.51 25.4,32.51 25.91,32 85.85,32 v86.36,32.51
H55  (via drill 0.45)
  Top 0.2: H2.23 141.22,59.94 141.22,56.9 139.7,55.37 v139.7,51.82 | v128.02,51.31 124.46,47.75 v124.46,39.12 | v107.7,28.45 v116.84,37.59 | v94.49,24.89 86.87,17.27 86.87,16.76 K55.2
  Bottom 0.2: v139.7,51.82 139.19,51.31 v128.02,51.31 | v124.46,39.12 122.94,37.59 v116.84,37.59 | v107.7,28.45 105.16,25.91 95.5,25.91 v94.49,24.89
H56  (via drill 0.45)
  Top 0.2: v163.58,64.52 164.08,64.01 v164.08,39.12 | v211.33,28.45 v206.76,33.02 | v218.95,25.4 218.95,3.05 217.42,1.52 97.54,1.52 v97.54,2.54
  Bottom 0.2: H2.24 143.26,64.52 150.88,64.52 151.38,64.01 151.89,64.52 v163.58,64.52 | v164.08,39.12 166.12,37.08 169.16,37.08 170.18,36.07 170.18,35.05 169.16,35.05 168.15,34.04 168.15,33.02 v206.76,33.02 | v211.33,28.45 214.38,25.4 v218.95,25.4 | v97.54,2.54 97.03,2.03 88.39,2.03 86.87,3.56 K56.2
H57  (via drill 0.45)
  Top 0.2: H2.25 134.62,58.42 134.62,53.85 133.6,52.83 132.59,52.83 132.59,53.34 132.08,53.85 132.08,55.37 131.06,56.39 127,56.39 127,53.34 124.46,50.8 124.46,48.77 123.95,48.26 123.95,39.62 122.43,38.1 v122.43,29.97 | v107.19,26.92 98.55,26.92 98.55,4.57 96.01,2.03 74.17,2.03 v74.17,3.05
  Bottom 0.2: v122.43,29.97 119.38,26.92 v107.19,26.92 | v74.17,3.05 71.12,3.05 70.1,2.03 64.01,2.03 62.48,3.56 K57.2
H58  (via drill 0.45)
  Top 0.2: v150.88,39.12 v150.88,62.48 | v150.88,35.56 150.37,35.05 v150.37,28.45 | v145.8,26.92 145.29,26.42 145.29,13.72 v145.8,13.21 | v74.17,26.92 v74.17,13.21
  Bottom 0.2: H2.26 138.18,62.48 v150.88,62.48 | v150.88,35.56 v150.88,39.12 | v150.37,28.45 148.84,26.92 v145.8,26.92 | v74.17,13.21 v145.8,13.21 | v74.17,26.92 73.66,27.43 64.01,27.43 62.48,28.96 K58.2
H59  (via drill 0.45)
  Top 0.2: v151.38,65.02 151.38,62.99 151.89,62.48 v151.89,39.62 | v127,28.45 v133.1,34.54 | v102.11,15.75 v111.25,24.89
  Bottom 0.2: H2.27 135.64,64.52 137.67,64.52 138.18,64.01 138.68,64.01 139.7,65.02 v151.38,65.02 | v151.89,39.62 151.89,34.54 v133.1,34.54 | v127,28.45 124.97,26.42 112.78,26.42 v111.25,24.89 | v102.11,15.75 100.58,14.22 64.52,14.22 62.48,16.26 K59.2
H60  (via drill 0.45)
  Top 0.2: H2.28 120.9,52.32 120.9,47.24 114.81,41.15 111.76,41.15 v111.76,53.34 | v66.55,52.83 66.04,53.34 66.04,55.37 v58.93,62.48 | v44.7,62.48 38.61,56.39 38.61,54.86 K60.2
  Bottom 0.2: v111.76,53.34 111.25,52.83 v66.55,52.83 | v44.7,62.48 v58.93,62.48
H61  (via drill 0.45)
  Top 0.2: H2.29 130.56,64.52 130.56,73.15 129.54,74.17 v129.54,86.36 | v146.3,92.96 146.81,93.47 146.81,119.89 v144.78,121.92 | v32.51,47.75 38.1,42.16 K61.2
  Bottom 0.2: v129.54,86.36 139.7,86.36 v146.3,92.96 | v144.78,121.92 25.91,121.92 20.83,116.84 19.81,116.84 6.6,103.63 6.6,96.52 4.57,96.52 3.56,95.5 3.56,47.75 v32.51,47.75
H62  (via drill 0.45)
  Top 0.2: H2.30 125.48,63.5 125.48,64.01 124.97,64.52 123.44,64.52 123.44,63.5 122.43,62.48 119.89,62.48 v119.89,63.5 | v105.16,63.5 104.14,64.52 v104.14,86.87 | v140.72,93.47 140.72,93.98 134.11,100.58 v126.49,100.58 | v64.01,101.09 55.88,92.96 53.85,92.96 v53.85,97.54 | v22.35,97.03 22.86,96.52 22.86,32 22.35,31.5 v22.35,28.45
  Bottom 0.2: v105.16,63.5 v119.89,63.5 | v104.14,86.87 104.65,87.38 127,87.38 127.51,86.87 129.03,86.87 129.54,87.38 132.08,87.38 132.59,86.87 138.68,86.87 139.7,87.88 139.7,91.95 139.19,92.46 140.21,93.47 v140.72,93.47 | v126.49,100.58 124.97,102.11 123.95,102.11 122.94,101.09 101.6,101.09 100.58,102.11 75.69,102.11 74.68,101.09 v64.01,101.09 | v53.85,97.54 53.34,97.03 v22.35,97.03 | v22.35,28.45 23.37,27.43 36.58,27.43 38.1,28.96 K62.2
H63  (via drill 0.45)
  Top 0.2: H2.31 119.89,58.93 v119.89,47.24 | v64.52,44.7 63.5,45.72 v63.5,50.29 | v58.42,50.29 55.88,47.75 v55.88,45.21
  Bottom 0.2: v119.89,47.24 117.35,44.7 v64.52,44.7 | v58.42,50.29 v63.5,50.29 | v55.88,45.21 55.37,44.7 34.54,44.7 29.46,39.62 24.38,39.62 19.3,34.54 19.3,18.8 36.07,18.8 38.1,16.76 K63.2
H64  (via drill 0.45)
  Top 0.2: H2.32 122.94,64.52 122.94,67.56 121.41,69.09 v121.41,69.6 | v152.4,69.6 153.92,68.07 v153.92,39.62 | v153.92,30.48 v153.92,34.54 | v143.76,26.42 144.27,25.91 144.27,15.24 142.24,13.21 120.9,13.21 v120.9,10.67 | v43.69,9.14 38.61,4.06 K64.2
  Bottom 0.2: v121.41,69.6 121.92,70.1 122.94,70.1 123.44,70.61 126.49,70.61 127,71.12 149.35,71.12 150.88,69.6 v152.4,69.6 | v153.92,34.54 v153.92,39.62 | v153.92,30.48 149.35,25.91 144.27,25.91 v143.76,26.42 | v120.9,10.67 119.89,9.65 82.3,9.65 81.79,10.16 77.22,10.16 76.2,9.14 v43.69,9.14
IO1  (via drill 0.45)
  Top 0.2: DA1.18 116.33,74.17 116.33,55.88 117.86,54.36 117.86,47.24 v112.78,42.16 | v68.58,40.64 68.58,55.37 v62.48,61.47
  Bottom 0.2: v112.78,42.16 110.24,39.62 101.09,39.62 99.57,41.15 99.06,41.15 98.04,42.16 78.23,42.16 77.22,41.15 69.09,41.15 v68.58,40.64 | v62.48,61.47 53.85,61.47 53.34,61.98 45.21,61.98 44.7,61.47 34.04,61.47 28.45,67.06 K1.1
IO2  (via drill 0.45)
  Top 0.2: v112.78,71.12 112.78,74.68 DA1.17 | v102.11,71.12 101.6,71.63 v101.6,77.72
  Bottom 0.2: v112.78,71.12 112.27,71.63 102.62,71.63 v102.11,71.12 | v101.6,77.72 101.09,77.22 30.99,77.22 28.45,79.76 K2.1
IO3  (via drill 0.45)
  Top 0.2: v109.22,83.31 109.22,81.79 110.24,80.77 110.24,75.18 DA1.16 | v99.06,78.23 v99.06,83.31 | v96.01,78.23 93.98,80.26 93.98,87.38 v94.49,87.88
  Bottom 0.2: v109.22,83.31 108.2,84.33 100.08,84.33 v99.06,83.31 | v96.01,78.23 v99.06,78.23 | v94.49,87.88 93.98,88.39 64.01,88.39 62.99,89.41 48.77,89.41 46.23,86.87 36.07,86.87 29.97,92.96 28.45,92.96 K3.1
IO4  (via drill 0.45)
  Top 0.2: DA1.15 106.68,73.66 106.68,50.29 104.14,47.75 104.14,44.7 v99.57,40.13 | v58.42,45.21 58.42,49.28 59.44,50.29 55.88,53.85 55.88,66.04 48.77,73.15 48.77,90.42 48.26,90.93 48.26,98.04 v48.77,98.55
  Bottom 0.2: v99.57,40.13 99.06,40.64 98.55,40.64 97.54,41.66 78.74,41.66 77.72,40.64 69.6,40.64 68.58,39.62 64.01,39.62 v58.42,45.21 | v48.77,98.55 47.24,100.08 33.53,100.08 28.45,105.16 K4.1
IO5  (via drill 0.45)
  Top 0.2: DA1.14 106.68,76.2 106.68,85.85 104.65,87.88 98.55,87.88 97.54,86.87 96.52,86.87 96.52,94.49 97.03,95 97.03,102.62 v96.01,103.63 | v82.8,111.25 v88.39,105.66
  Bottom 0.2: v96.01,103.63 90.42,103.63 v88.39,105.66 | v82.8,111.25 27.94,111.25 24.89,114.3 24.89,117.86 27.94,117.86 K5.1
IO6  (via drill 0.45)
  Top 0.2: v103.12,77.72 103.12,75.18 DA1.13 | v53.34,90.42 v53.34,81.79
  Bottom 0.2: v103.12,77.72 101.6,79.25 86.87,79.25 85.34,77.72 57.4,77.72 v53.34,81.79 | v53.34,90.42 53.34,92.46 52.32,92.46 K6.1
IO7  (via drill 0.45)
  Top 0.2: DA1.12 97.54,77.72 97.54,80.77 96.52,81.79 96.52,85.85 96.01,86.36 v96.01,95 | v40.64,101.09 v46.23,95.5
  Bottom 0.2: v96.01,95 95,96.01 81.79,96.01 81.28,95.5 71.12,95.5 70.61,96.01 46.74,96.01 v46.23,95.5 | v40.64,101.09 36.58,105.16 36.58,107.19 50.29,107.19 51.82,105.66 K7.1
IO8  (via drill 0.45)
  Top 0.2: v98.04,71.63 98.04,74.68 DA1.11 | v52.83,72.14 50.29,74.68 v50.29,116.33
  Bottom 0.2: v98.04,71.63 97.54,71.12 77.72,71.12 76.2,72.64 53.34,72.64 v52.83,72.14 | v50.29,116.33 51.82,117.86 K8.1
IO9  (via drill 0.45)
  Top 0.2: v125.98,88.9 125.98,82.8 DA2.18
  Bottom 0.2: v125.98,88.9 85.85,88.9 81.28,93.47 77.22,93.47 76.71,92.96 K9.1
IO10  (via drill 0.45)
  Top 0.2: DA2.17 127.51,83.31 v127.51,87.88 | v97.54,87.88 97.54,104.14 96.01,105.66 v96.01,109.22 | v80.26,109.22 76.71,105.66 K10.1
  Bottom 0.2: v97.54,87.88 v127.51,87.88 | v80.26,109.22 v96.01,109.22
IO11  (via drill 0.45)
  Top 0.2: v117.86,80.26 117.35,79.76 v117.35,71.63 | v76.2,71.63 73.66,74.17 v73.66,116.84
  Bottom 0.2: DA2.16 128.52,80.26 v117.86,80.26 | v117.35,71.63 116.84,72.14 99.57,72.14 98.04,70.61 77.22,70.61 v76.2,71.63 | v73.66,116.84 74.68,117.86 76.2,117.86 K11.1
IO12  (via drill 0.45)
  Top 0.2: DA2.15 132.59,83.31 v132.59,87.88
  Bottom 0.2: v132.59,87.88 131.06,89.41 126.49,89.41 125.48,90.42 102.62,90.42 100.58,92.46 K12.1
IO13  (via drill 0.45)
  Top 0.2: v111.25,84.33 104.65,90.93 98.55,90.93 98.55,105.16 v98.04,105.66
  Bottom 0.2: DA2.14 134.11,84.33 v111.25,84.33 | v98.04,105.66 100.08,105.66 K13.1
IO14  (via drill 0.45)
  Top 0.2: v109.22,85.34 104.14,90.42 98.04,90.42 98.04,104.65 97.03,105.66 v97.03,116.84
  Bottom 0.2: DA2.13 135.64,85.34 v109.22,85.34 | v97.03,116.84 98.04,117.86 100.08,117.86 K14.1
IO15  (via drill 0.45)
  Top 0.2: DA2.12 138.68,84.84 v138.68,87.88
  Bottom 0.2: v138.68,87.88 137.16,89.41 132.59,89.41 129.03,92.96 124.97,92.96 K15.1
IO16  (via drill 0.45)
  Top 0.2: DA2.11 144.27,83.31 144.27,101.6 v143.26,102.62
  Bottom 0.2: v143.26,102.62 142.75,103.12 127,103.12 124.97,105.16 K16.1
IO17  (via drill 0.45)
  Top 0.2: v187.96,80.26 DA3.18 | v140.21,92.46 134.11,98.55 v123.95,98.55 | v122.43,99.57 122.43,101.6 123.44,102.62 123.44,103.12 122.43,104.14 122.43,114.81 v122.94,115.32
  Bottom 0.2: v187.96,80.26 187.45,80.77 154.43,80.77 146.3,88.9 146.3,91.95 147.32,92.96 147.32,93.98 145.8,93.98 142.75,90.93 141.73,90.93 v140.21,92.46 | v123.95,98.55 122.94,99.57 v122.43,99.57 | v122.94,115.32 122.43,115.32 121.41,116.33 121.41,117.86 124.46,117.86 K17.1
IO18  (via drill 0.45)
  Top 0.2: v186.44,87.88 186.44,76.2 185.42,75.18 DA3.17
  Bottom 0.2: v186.44,87.88 161.04,87.88 155.96,92.96 148.84,92.96 K18.1
IO19  (via drill 0.45)
  Top 0.2: v144.78,103.12 v144.78,72.64
  Bottom 0.2: v144.78,72.64 151.89,72.64 152.4,73.15 181.36,73.15 182.88,74.68 DA3.16 | v144.78,103.12 146.81,105.16 148.34,105.16 K19.1
IO20  (via drill 0.45)
  Top 0.2: v180.34,78.74 DA3.15 | v120.9,78.23 120.9,113.79 v120.4,114.3
  Bottom 0.2: v180.34,78.74 179.83,79.25 160.02,79.25 159.51,78.74 137.67,78.74 137.16,78.23 v120.9,78.23 | v120.4,114.3 123.95,114.3 125.48,115.82 146.3,115.82 148.34,117.86 K20.1
IO21  (via drill 0.45)
  Top 0.2: v176.28,90.42 176.28,76.71 177.8,75.18 DA3.14
  Bottom 0.2: v176.28,90.42 174.24,92.46 173.23,92.46 K21.1
IO22  (via drill 0.45)
  Top 0.2: v170.69,105.16 170.69,90.93 173.23,90.93 174.75,89.41 174.24,88.9 174.24,76.2 175.26,75.18 DA3.13
  Bottom 0.2: v170.69,105.16 172.72,105.16 K22.1
IO23  (via drill 0.45)
  Top 0.2: v169.67,117.35 169.67,105.16 170.18,104.65 170.18,90.42 171.2,89.41 171.2,76.71 172.72,75.18 DA3.12
  Bottom 0.2: v169.67,117.35 170.18,117.86 172.72,117.86 K23.1
IO24  (via drill 0.45)
  Top 0.2: v185.93,90.42 179.32,83.82 179.32,74.17 174.24,69.09 174.24,65.02 172.21,65.02 171.7,65.53 171.7,73.15 170.18,74.68 DA3.11
  Bottom 0.2: v185.93,90.42 186.44,90.93 195.07,90.93 196.6,92.46 K24.1
IO25  (via drill 0.45)
  Top 0.2: v195.58,82.8 195.07,83.31 195.07,103.63 v194.56,104.14
  Bottom 0.2: v195.58,82.8 198.12,82.8 DA4.18 | v194.56,104.14 195.58,105.16 196.6,105.16 K25.1
IO26  (via drill 0.45)
  Top 0.2: v197.61,89.41 197.61,85.85 200.66,82.8 DA4.17 | v193.55,89.41 193.04,89.92 v193.04,114.3
  Bottom 0.2: v193.55,89.41 v197.61,89.41 | v193.04,114.3 196.6,117.86 K26.1
IO27  (via drill 0.45)
  Top 0.2: v210.82,90.42 203.2,82.8 DA4.16
  Bottom 0.2: v210.82,90.42 211.33,90.93 219.46,90.93 220.98,92.46 K27.1
IO28  (via drill 0.45)
  Top 0.2: v216.92,104.65 216.92,90.42 212.85,90.42 206.76,84.33 206.76,83.82 205.74,82.8 DA4.15
  Bottom 0.2: v216.92,104.65 217.42,105.16 220.98,105.16 K28.1
IO29  (via drill 0.45)
  Top 0.2: v217.93,116.33 217.93,104.65 217.42,104.14 217.42,89.92 214.88,89.92 211.33,86.36 211.33,85.85 208.28,82.8 DA4.14
  Bottom 0.2: v217.93,116.33 219.46,117.86 220.98,117.86 K29.1
IO30  (via drill 0.45)
  Top 0.2: v211.84,85.34 211.84,83.82 210.82,82.8 DA4.13
  Bottom 0.2: v211.84,85.34 212.34,84.84 242.32,84.84 245.36,87.88 245.36,92.46 K30.1
IO31  (via drill 0.45)
  Top 0.2: v213.36,85.85 DA4.12 | v241.3,85.85 242.32,86.87 v242.32,104.14
  Bottom 0.2: v241.3,85.85 v213.36,85.85 | v242.32,104.14 243.33,105.16 244.86,105.16 K31.1
IO32  (via drill 0.45)
  Top 0.2: v239.78,80.77 240.28,81.28 240.28,90.93 241.3,91.95 v241.3,116.84
  Bottom 0.2: v239.78,80.77 217.42,80.77 215.9,82.3 DA4.11 | v241.3,116.84 242.32,117.86 244.86,117.86 K32.1
IO33  (via drill 0.45)
  Top 0.2: v240.79,27.43 219.46,27.43 218.95,27.94 218.95,46.23 218.44,46.74 DA5.18
  Bottom 0.2: v240.79,27.43 242.32,28.96 244.86,28.96 K33.1
IO34  (via drill 0.45)
  Top 0.2: v215.39,39.12 215.39,46.23 215.9,46.74 DA5.17 | v242.82,38.1 243.33,37.59 v243.33,14.73
  Bottom 0.2: v215.39,39.12 239.78,39.12 240.79,38.1 v242.82,38.1 | v243.33,14.73 244.86,16.26 K34.1
IO35  (via drill 0.45)
  Top 0.2: v213.36,41.66 DA5.16 | v241.81,34.04 241.81,17.78 241.3,17.27 v241.3,6.6
  Bottom 0.2: v213.36,41.66 213.87,41.15 242.82,41.15 246.89,37.08 246.89,34.04 v241.81,34.04 | v241.3,6.6 243.84,4.06 244.86,4.06 K35.1
IO36  (via drill 0.45)
  Top 0.2: v210.82,44.2 DA5.15 | v216.41,42.67 216.92,42.16 v216.92,28.45
  Bottom 0.2: v210.82,44.2 212.34,42.67 v216.41,42.67 | v216.92,28.45 217.42,28.96 220.98,28.96 K36.1
IO37  (via drill 0.45)
  Top 0.2: v217.93,19.81 217.93,28.45 217.42,28.96 217.42,48.77 209.8,48.77 208.28,47.24 DA5.14
  Bottom 0.2: v217.93,19.81 220.98,16.76 K37.1
IO38  (via drill 0.45)
  Top 0.2: v204.22,43.69 204.22,45.21 205.74,46.74 DA5.13 | v193.04,42.16 193.55,41.66 193.55,32.51 192.53,31.5 192.53,4.57 195.07,2.03 216.92,2.03 216.92,3.05 217.93,4.06 v217.93,4.57
  Bottom 0.2: v204.22,43.69 201.68,41.15 197.1,41.15 196.09,42.16 v193.04,42.16 | v217.93,4.57 218.44,4.06 220.98,4.06 K38.1
IO39  (via drill 0.45)
  Top 0.2: v203.2,44.2 DA5.12 | v198.63,42.16 195.07,38.61 195.07,29.97 v194.56,29.46
  Bottom 0.2: v203.2,44.2 201.17,42.16 v198.63,42.16 | v194.56,29.46 196.6,29.46 K39.1
IO40  (via drill 0.45)
  Top 0.2: v199.64,44.2 199.64,45.72 200.66,46.74 DA5.11 | v197.1,42.16 194.56,39.62 194.56,30.48 193.55,29.46 193.55,21.34 194.56,20.32 v194.56,17.78
  Bottom 0.2: v199.64,44.2 197.61,42.16 v197.1,42.16 | v194.56,17.78 195.58,16.76 196.6,16.76 K40.1
IO41  (via drill 0.45)
  Top 0.2: v165.1,40.64 v165.1,51.82 | v161.54,37.59 164.59,34.54 v164.59,28.96 | v194.56,21.34 v194.56,25.91 | v193.55,4.57 v193.55,20.32
  Bottom 0.2: v165.1,51.82 167.64,54.36 DA6.18 | v165.1,40.64 164.59,40.13 164.08,40.13 v161.54,37.59 | v164.59,28.96 167.64,25.91 v194.56,25.91 | v193.55,20.32 v194.56,21.34 | v193.55,4.57 194.06,4.06 196.6,4.06 K41.1
IO42  (via drill 0.45)
  Top 0.2: v170.69,30.48 170.69,38.1 171.2,38.61 171.2,53.34 170.18,54.36 DA6.17
  Bottom 0.2: v170.69,30.48 171.7,29.46 172.72,29.46 K42.1
IO43  (via drill 0.45)
  Top 0.2: v169.16,20.32 168.15,21.34 168.15,36.07 168.66,36.58 168.66,56.39 169.16,56.9 169.16,64.52 170.69,64.52 171.2,64.01 171.2,56.39 172.72,54.86 DA6.16
  Bottom 0.2: v169.16,20.32 172.72,16.76 K43.1
IO44  (via drill 0.45)
  Top 0.2: v192.53,36.07 192.53,38.61 179.83,38.61 174.24,44.2 174.24,53.34 175.26,54.36 DA6.15 | v170.18,28.45 170.69,27.94 v170.69,5.08
  Bottom 0.2: v192.53,36.07 194.56,34.04 206.76,34.04 207.77,33.02 207.77,32 194.06,32 193.55,32.51 171.7,32.51 169.67,30.48 169.67,28.45 v170.18,28.45 | v170.69,5.08 171.7,4.06 172.72,4.06 K44.1
IO45  (via drill 0.45)
  Top 0.2: v177.8,51.82 DA6.14 | v145.29,45.21 145.8,44.7 145.8,33.02 146.3,32.51 146.3,29.46 v145.8,28.96
  Bottom 0.2: v177.8,51.82 175.77,49.78 150.88,49.78 146.3,45.21 v145.29,45.21 | v145.8,28.96 148.34,28.96 K45.1
IO46  (via drill 0.45)
  Top 0.2: v123.44,50.29 123.44,40.13 121.41,38.1 121.41,21.34 v122.43,20.32 | v147.83,19.3 148.34,18.8 148.34,16.76 K46.1
  Bottom 0.2: v123.44,50.29 128.02,50.29 128.52,50.8 149.86,50.8 155.45,56.39 178.82,56.39 180.34,54.86 DA6.13 | v122.43,20.32 123.44,19.3 v147.83,19.3
IO47  (via drill 0.45)
  Top 0.2: v76.2,60.45 73.66,57.91 73.66,29.46 73.15,28.96 v73.15,1.52